# EAGLE schematic Main_Board_Rev_A1 (EAGLE 7.7.0)

## Sheet 1 of 5: Ethernet&CAN
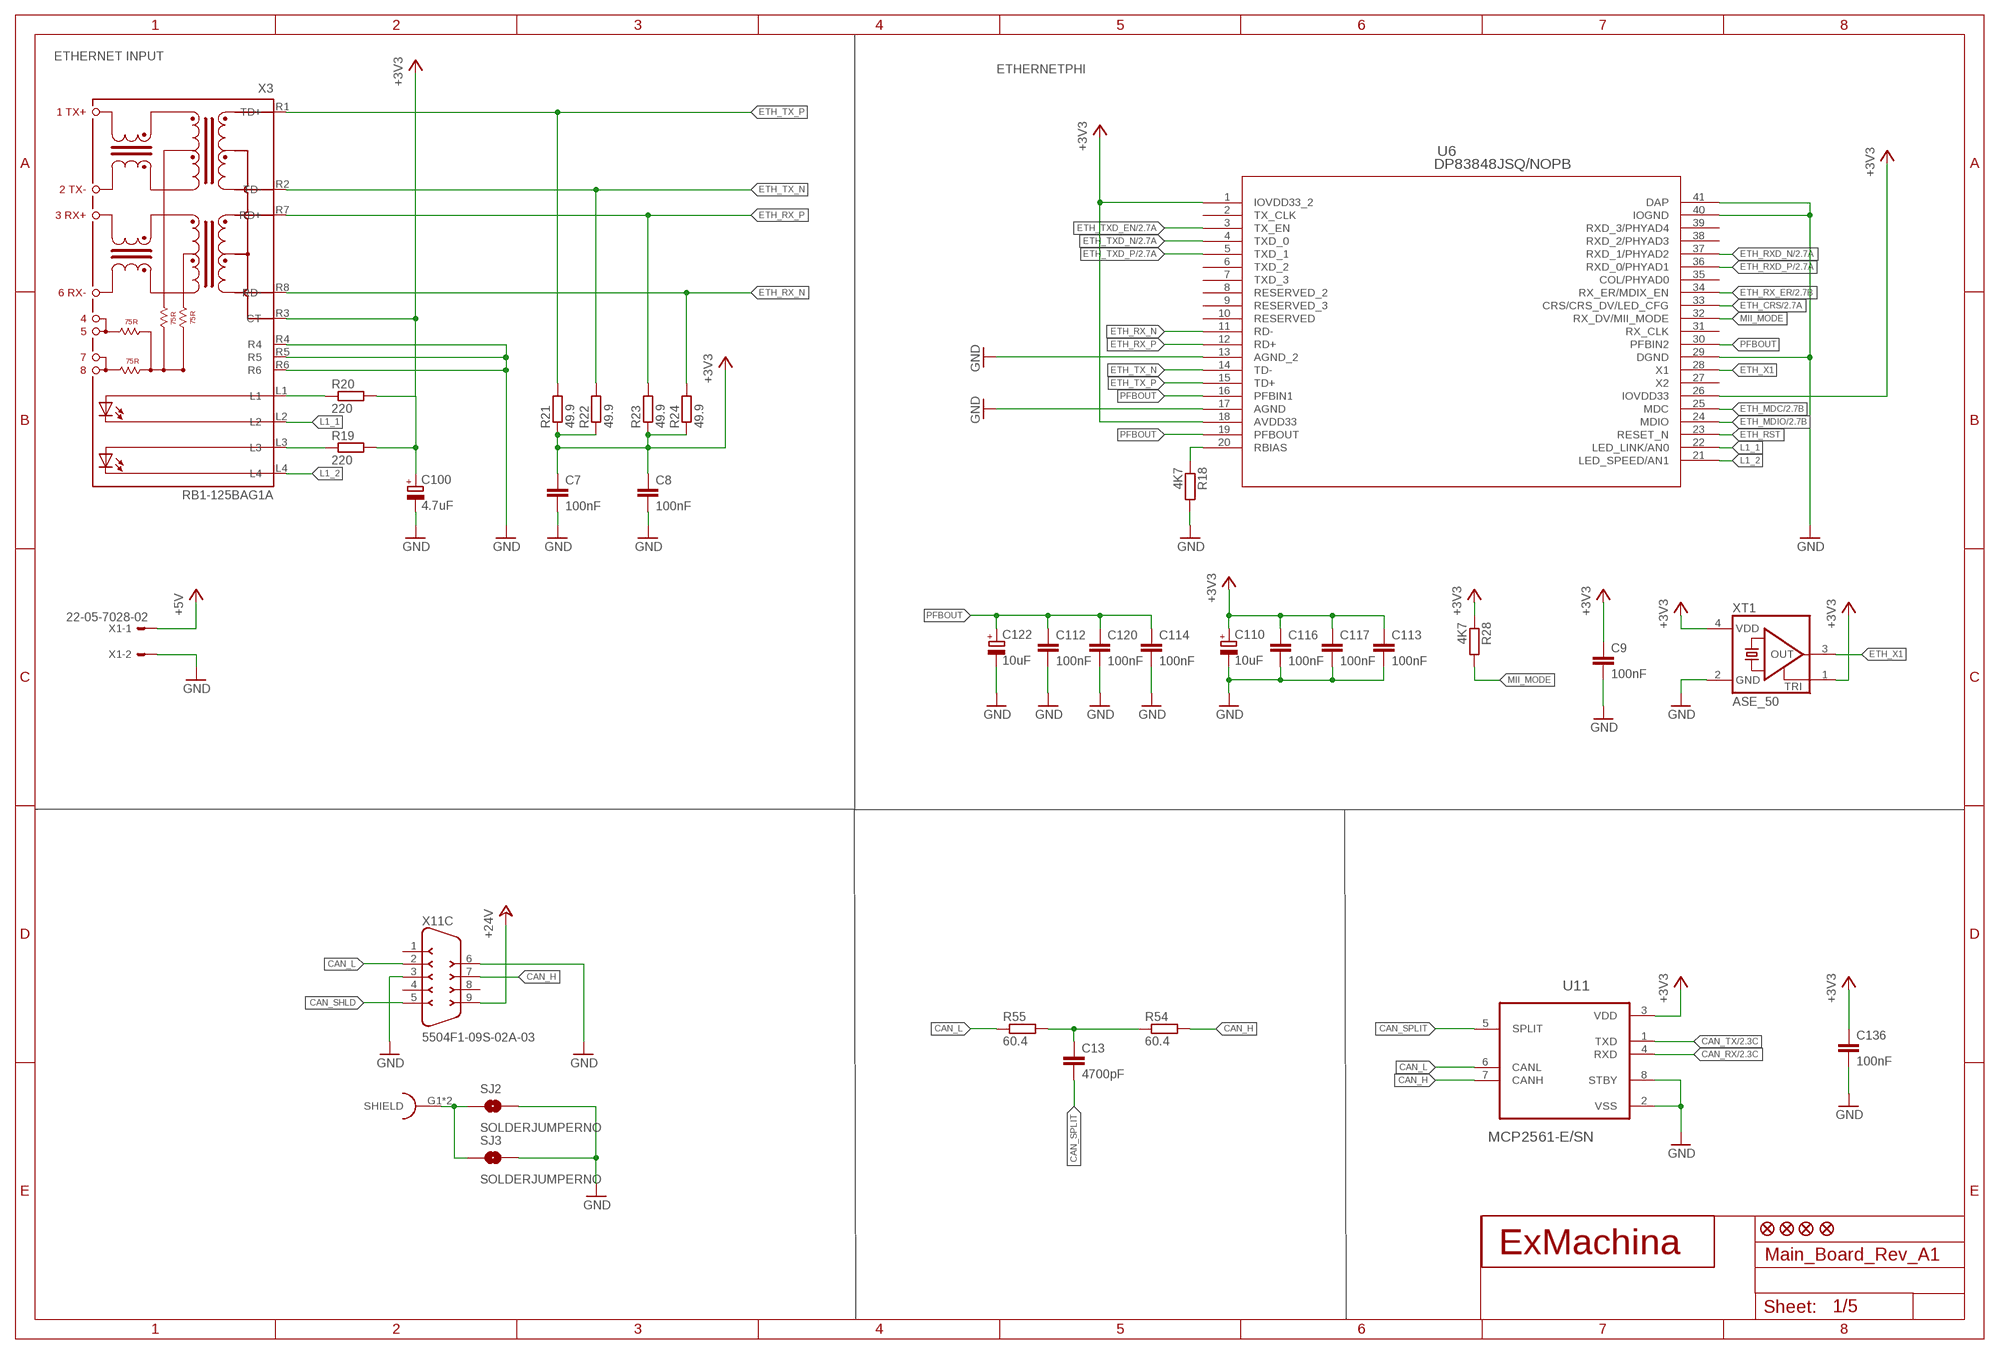
[diagram p0: schematic, sheet 1]

### Parts
C7  100nF  C-EUC0603  [C0603]
C8  100nF  C-EUC0603  [C0603]
C9  100nF  C-EUC0603  [C0603]
C13  4700pF  C-EUC0603  [C0603]
C100  4.7uF  CPOL-EUCT3216  [CT3216]
C110  10uF  CPOL-EUCT3216  [CT3216]
C112  100nF  C-EUC0603  [C0603]
C113  100nF  C-EUC0603  [C0603]
C114  100nF  C-EUC0603  [C0603]
C116  100nF  C-EUC0603  [C0603]
C117  100nF  C-EUC0603  [C0603]
C120  100nF  C-EUC0603  [C0603]
C122  10uF  CPOL-EUCT3216  [CT3216]
C136  100nF  C-EUC0603  [C0603]
JP1  FIDUCIAL1X2  [FIDUCIAL-1X2]
JP2  FIDUCIAL1X2  [FIDUCIAL-1X2]
JP4  FIDUCIAL1X2  [FIDUCIAL-1X2]
JP5  FIDUCIAL1X2  [FIDUCIAL-1X2]
R18  4K7  R-EU_R0603  [R0603]
R19  220  R-EU_R0603  [R0603]
R20  220  R-EU_R0603  [R0603]
R21  49.9  R-EU_R0603  [R0603]
R22  49.9  R-EU_R0603  [R0603]
R23  49.9  R-EU_R0603  [R0603]
R24  49.9  R-EU_R0603  [R0603]
R28  4K7  R-EU_R0603  [R0603]
R54  60.4  R-EU_R0603  [R0603]
R55  60.4  R-EU_R0603  [R0603]
SJ2  SOLDERJUMPERNO  [SJ_2S-NO]
SJ3  SOLDERJUMPERNO  [SJ_2S-NO]
U6  DP83848JSQ/NOPB  [SQA40B]
U11  MCP2561-E/SN  [SOIC127P600X175-8N]
U$2  EXMACHINA-LOGO-NAME  [EXM-LOGO-BASELINE]
X1  22-05-7028-02  [7395-02]
X3  RB1-125BAG1A  [WIZNET_RB1-125BAG1A]
X11  5504F1-09S-02A-03  [5504F1-09S-02A]
XT1  ASE_50  ASE  [ASE]

### Nets
+3V3 [supply]: C7.1 C8.1 C9.1 C100.+ C110.+ C113.1 C116.1 C117.1 C136.1 R19.2 R20.2 R21.1 R22.1 R23.1 R24.1 R28.1 U6.1(IOVDD33_2) U6.18(AVDD33) U6.26(IOVDD33) U11.3(VDD) X3.R3(CT) XT1.1(TRI) XT1.4(VDD) ; also sheet 2,3,4,5
+5V [supply]: X1.1 ; also sheet 3,4,5
+24V: X11.9 ; also sheet 3,5
CAN_H [signal]: R54.2 U11.7(CANH) X11.7
CAN_L [signal]: R55.1 U11.6(CANL) X11.2
CAN_RX [signal]: U11.4(RXD) ; also sheet 2
CAN_SHLD: X11.5
CAN_SPLIT [signal]: C13.2 U11.5(SPLIT)
CAN_TX [signal]: U11.1(TXD) ; also sheet 2
ETH_CRS [signal]: U6.33(CRS/CRS_DV/LED_CFG) ; also sheet 2
ETH_MDC [signal]: U6.25(MDC) ; also sheet 2
ETH_MDIO [signal]: U6.24(MDIO) ; also sheet 2
ETH_RST [signal]: U6.23(RESET_N)
ETH_RX_ER [signal]: U6.34(RX_ER/MDIX_EN) ; also sheet 2
ETH_RX_N [signal]: R24.2 U6.11(RD-) X3.R8(RD-)
ETH_RX_P [signal]: R23.2 U6.12(RD+) X3.R7(RD+)
ETH_RXD_N [signal]: U6.37(RXD_1/PHYAD2) ; also sheet 2
ETH_RXD_P [signal]: U6.36(RXD_0/PHYAD1) ; also sheet 2
ETH_TX_N [signal]: R22.2 U6.14(TD-) X3.R2(TD-)
ETH_TX_P [signal]: R21.2 U6.15(TD+) X3.R1(TD+)
ETH_TXD_EN [signal]: U6.3(TX_EN) ; also sheet 2
ETH_TXD_N [signal]: U6.4(TXD_0) ; also sheet 2
ETH_TXD_P [signal]: U6.5(TXD_1) ; also sheet 2
ETH_X1 [signal]: U6.28(X1) XT1.3(OUT)
GND [supply]: C7.2 C8.2 C9.2 C100.- C110.- C112.2 C113.2 C114.2 C116.2 C117.2 C120.2 C122.- C136.2 R18.2 SJ2.2 SJ3.2 U6.13(AGND_2) U6.17(AGND) U6.29(DGND) U6.40(IOGND) U6.41(DAP) U11.2(VSS) U11.8(STBY) X1.2 X3.R4 X3.R5 X3.R6 X11.3 X11.6 XT1.2(GND) ; also sheet 2,3,4,5
L1_1 [signal]: U6.22(LED_LINK/AN0) X3.L2
L1_2 [signal]: U6.21(LED_SPEED/AN1) X3.L4
MII_MODE [signal]: R28.2 U6.32(RX_DV/MII_MODE)
N$3: C13.1 R54.1 R55.2
N$4: R18.1 U6.20(RBIAS)
N$6: SJ2.1 SJ3.1 X11.G1(S:SHIELD) X11.G2(S:SHIELD)
N$8 [signal]: R20.1 X3.L1
N$9 [signal]: R19.1 X3.L3
PFBOUT [signal]: C112.1 C114.1 C120.1 C122.+ U6.16(PFBIN1) U6.19(PFBOUT) U6.30(PFBIN2)
Unconnected: U6.2(TX_CLK) U6.6(TXD_2) U6.7(TXD_3) U6.8(RESERVED_2) U6.9(RESERVED_3) U6.10(RESERVED) U6.27(X2) U6.31(RX_CLK) U6.35(COL/PHYAD0) U6.38(RXD_2/PHYAD3) U6.39(RXD_3/PHYAD4) X11.1 X11.4 X11.8

### Notes on the sheet
- ETHERNET INPUT
- ETHERNETPHI

## Sheet 2 of 5: LPC1768 + EEPROM
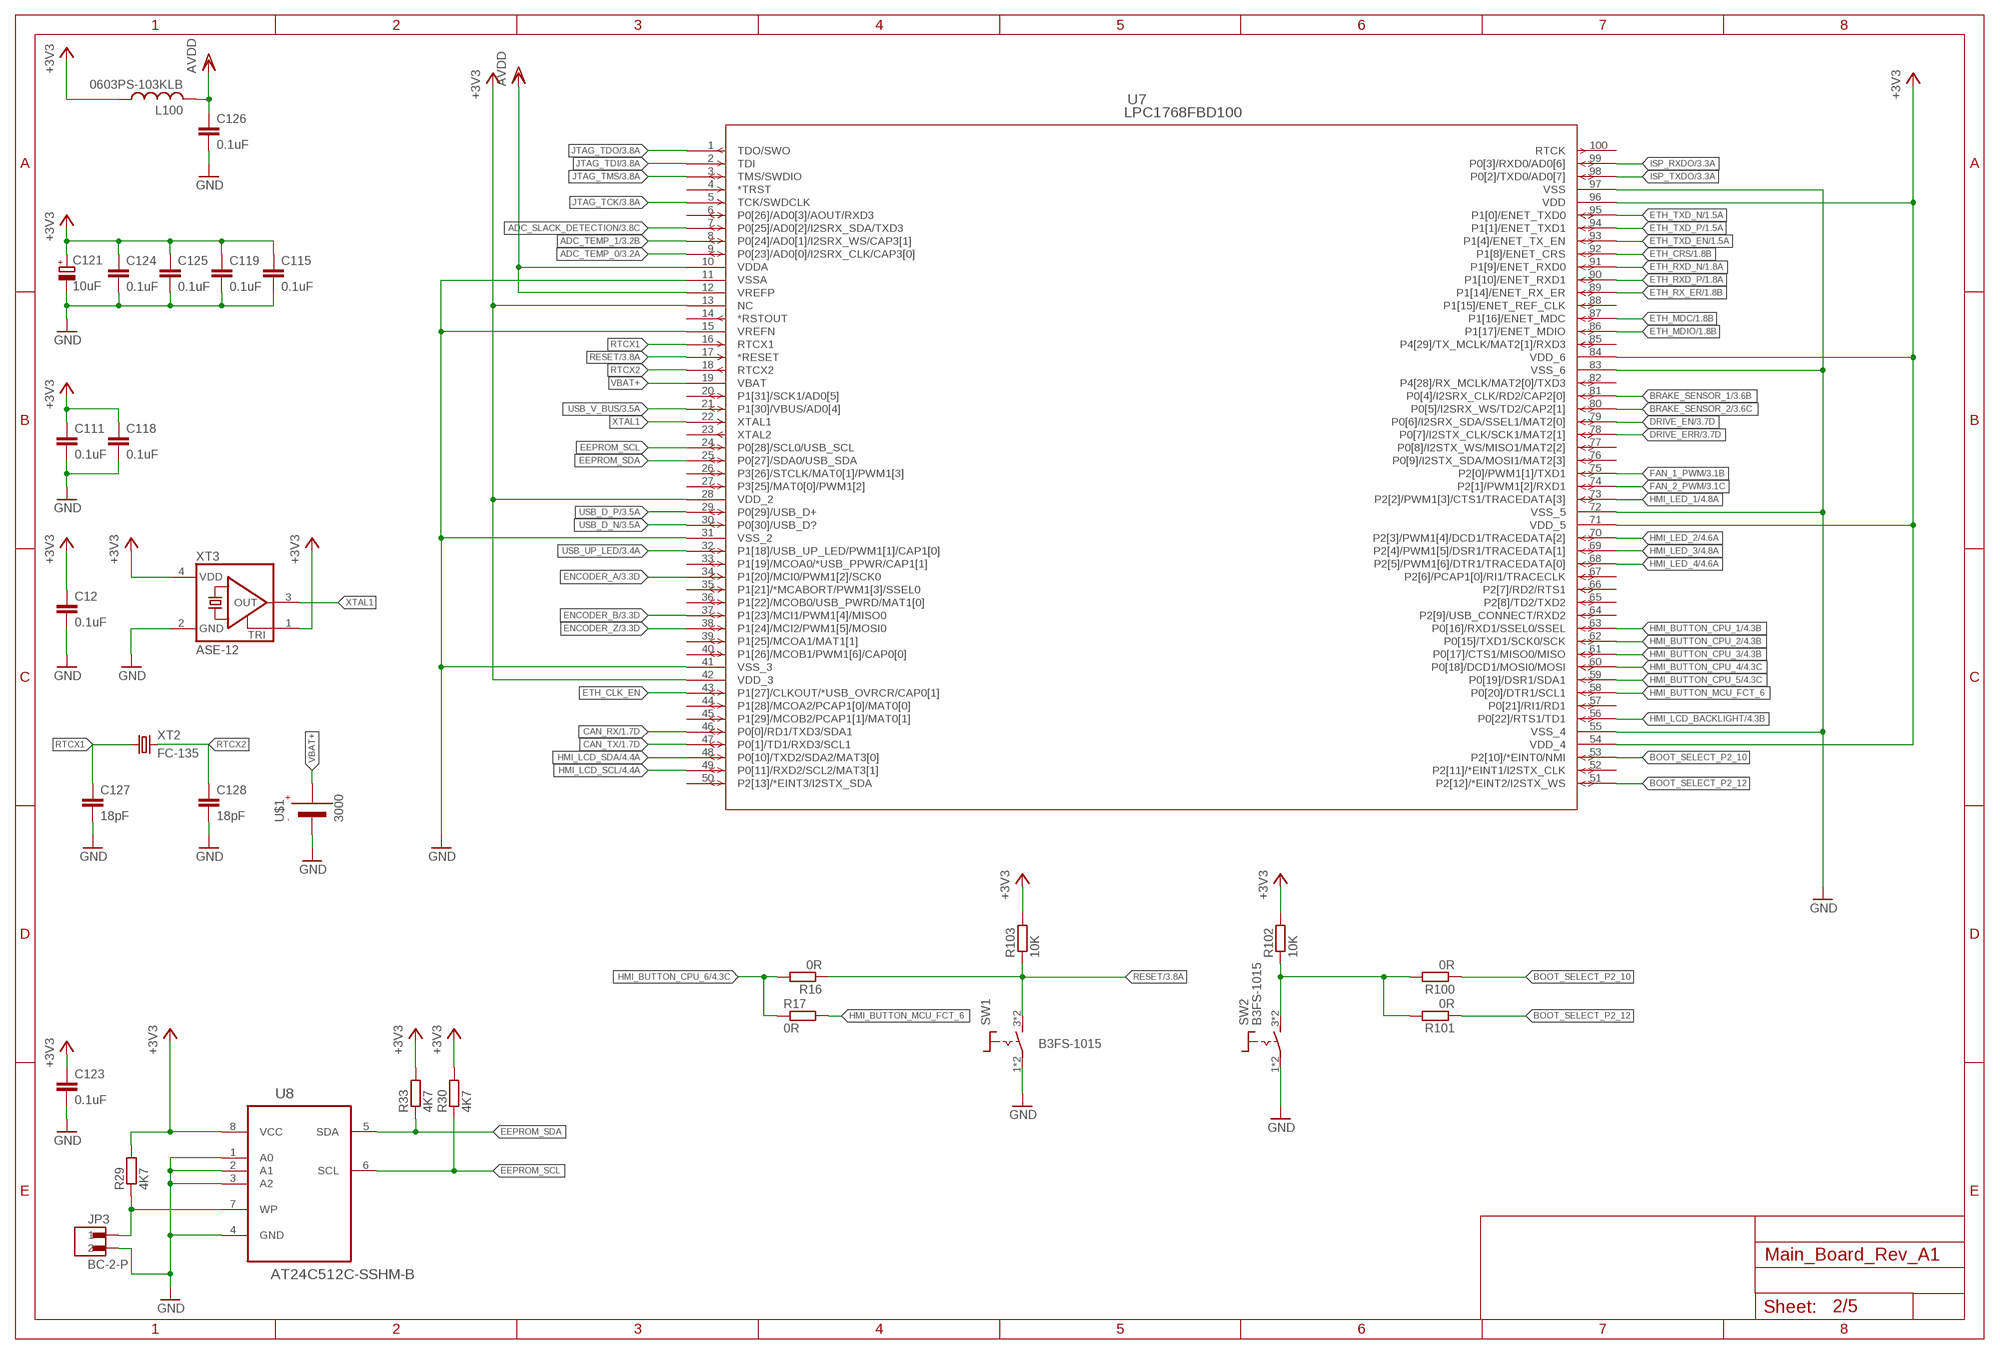
[diagram p1: schematic, sheet 2]

### Parts
C12  0.1uF  C-EUC0603  [C0603]
C111  0.1uF  C-EUC0603  [C0603]
C115  0.1uF  C-EUC0603  [C0603]
C118  0.1uF  C-EUC0603  [C0603]
C119  0.1uF  C-EUC0603  [C0603]
C121  10uF  CPOL-EUCT3216  [CT3216]
C123  0.1uF  C-EUC0603  [C0603]
C124  0.1uF  C-EUC0603  [C0603]
C125  0.1uF  C-EUC0603  [C0603]
C126  0.1uF  C-EUC0603  [C0603]
C127  18pF  C-EUC0603  [C0603]
C128  18pF  C-EUC0603  [C0603]
JP3  BC-2-P  [BC-2-P]
L100  0603PS-103KLB  0603PS  [0603]
R16  0R  R-EU_R0603  [R0603]
R17  0R  R-EU_R0603  [R0603]
R29  4K7  R-EU_R0603  [R0603]
R30  4K7  R-EU_R0603  [R0603]
R33  4K7  R-EU_R0603  [R0603]
R100  0R  R-EU_R0603  [R0603]
R101  0R  R-EU_R0603  [R0603]
R102  10K  R-EU_R0603  [R0603]
R103  10K  R-EU_R0603  [R0603]
SW1  B3FS-1015  [B3FS]
SW2  B3FS-1015  [B3FS]
U7  LPC1768FBD100  [SOT407-1]
U8  AT24C512C-SSHM-B  [SOIC127P600X175-8N]
U$1  3000  [3000]
XT2  FC-135  [FC-135]
XT3  ASE-12  ASE  [ASE]

### Nets
+3V3 [supply]: C12.1 C111.1 C115.1 C118.1 C119.1 C121.+ C123.1 C124.1 C125.1 L100.P$1 R29.2 R30.2 R33.2 R102.2 R103.2 U7.13(NC) U7.28(VDD_2) U7.42(VDD_3) U7.54(VDD_4) U7.71(VDD_5) U7.84(VDD_6) U7.96(VDD) U8.8(VCC) XT3.1(TRI) XT3.4(VDD) ; also sheet 1,3,4,5
ADC_SLACK_DETECTION [signal]: U7.7(P0[25]/AD0[2]/I2SRX_SDA/TXD3) ; also sheet 3
ADC_TEMP_0 [signal]: U7.9(P0[23]/AD0[0]/I2SRX_CLK/CAP3[0]) ; also sheet 3
ADC_TEMP_1 [signal]: U7.8(P0[24]/AD0[1]/I2SRX_WS/CAP3[1]) ; also sheet 3
AVDD: C126.1 L100.P$2 U7.10(VDDA) U7.12(VREFP) ; also sheet 3
BOOT_SELECT_P2_10 [signal]: R100.1 U7.53(P2[10]/*EINT0/NMI)
BOOT_SELECT_P2_12 [signal]: R101.1 U7.51(P2[12]/*EINT2/I2STX_WS)
BRAKE_SENSOR_1: U7.81(P0[4]/I2SRX_CLK/RD2/CAP2[0]) ; also sheet 3
BRAKE_SENSOR_2: U7.80(P0[5]/I2SRX_WS/TD2/CAP2[1]) ; also sheet 3
CAN_RX [signal]: U7.46(P0[0]/RD1/TXD3/SDA1) ; also sheet 1
CAN_TX [signal]: U7.47(P0[1]/TD1/RXD3/SCL1) ; also sheet 1
DRIVE_EN: U7.79(P0[6]/I2SRX_SDA/SSEL1/MAT2[0]) ; also sheet 3
DRIVE_ERR: U7.78(P0[7]/I2STX_CLK/SCK1/MAT2[1]) ; also sheet 3
EEPROM_SCL: R30.1 U7.24(P0[28]/SCL0/USB_SCL) U8.6(SCL)
EEPROM_SDA: R33.1 U7.25(P0[27]/SDA0/USB_SDA) U8.5(SDA)
ENCODER_A: U7.34(P1[20]/MCI0/PWM1[2]/SCK0) ; also sheet 3
ENCODER_B: U7.37(P1[23]/MCI1/PWM1[4]/MISO0) ; also sheet 3
ENCODER_Z: U7.38(P1[24]/MCI2/PWM1[5]/MOSI0) ; also sheet 3
ETH_CLK_EN [signal]: U7.43(P1[27]/CLKOUT/*USB_OVRCR/CAP0[1])
ETH_CRS [signal]: U7.92(P1[8]/ENET_CRS) ; also sheet 1
ETH_MDC [signal]: U7.87(P1[16]/ENET_MDC) ; also sheet 1
ETH_MDIO [signal]: U7.86(P1[17]/ENET_MDIO) ; also sheet 1
ETH_RX_ER [signal]: U7.89(P1[14]/ENET_RX_ER) ; also sheet 1
ETH_RXD_N [signal]: U7.91(P1[9]/ENET_RXD0) ; also sheet 1
ETH_RXD_P [signal]: U7.90(P1[10]/ENET_RXD1) ; also sheet 1
ETH_TXD_EN [signal]: U7.93(P1[4]/ENET_TX_EN) ; also sheet 1
ETH_TXD_N [signal]: U7.95(P1[0]/ENET_TXD0) ; also sheet 1
ETH_TXD_P [signal]: U7.94(P1[1]/ENET_TXD1) ; also sheet 1
FAN_1_PWM [signal]: U7.75(P2[0]/PWM1[1]/TXD1) ; also sheet 3
FAN_2_PWM [signal]: U7.74(P2[1]/PWM1[2]/RXD1) ; also sheet 3
GND [supply]: C12.2 C111.2 C115.2 C118.2 C119.2 C121.- C123.2 C124.2 C125.2 C126.2 C127.2 C128.2 JP3.2 SW1.1 SW1.2 SW2.1 SW2.2 U7.11(VSSA) U7.15(VREFN) U7.31(VSS_2) U7.41(VSS_3) U7.55(VSS_4) U7.72(VSS_5) U7.83(VSS_6) U7.97(VSS) U8.1(A0) U8.2(A1) U8.3(A2) U8.4(GND) U$1.-(VBAT-) XT3.2(GND) ; also sheet 1,3,4,5
HMI_BUTTON_CPU_1: U7.63(P0[16]/RXD1/SSEL0/SSEL) ; also sheet 4
HMI_BUTTON_CPU_2: U7.62(P0[15]/TXD1/SCK0/SCK) ; also sheet 4
HMI_BUTTON_CPU_3: U7.61(P0[17]/CTS1/MISO0/MISO) ; also sheet 4
HMI_BUTTON_CPU_4: U7.60(P0[18]/DCD1/MOSI0/MOSI) ; also sheet 4
HMI_BUTTON_CPU_5: U7.59(P0[19]/DSR1/SDA1) ; also sheet 4
HMI_BUTTON_CPU_6: R16.2 R17.1 ; also sheet 4
HMI_BUTTON_MCU_FCT_6: R17.2 U7.58(P0[20]/DTR1/SCL1)
HMI_LCD_BACKLIGHT: U7.56(P0[22]/RTS1/TD1) ; also sheet 4
HMI_LCD_SCL [signal]: U7.49(P0[11]/RXD2/SCL2/MAT3[1]) ; also sheet 4
HMI_LCD_SDA [signal]: U7.48(P0[10]/TXD2/SDA2/MAT3[0]) ; also sheet 4
HMI_LED_1 [signal]: U7.73(P2[2]/PWM1[3]/CTS1/TRACEDATA[3]) ; also sheet 4
HMI_LED_2 [signal]: U7.70(P2[3]/PWM1[4]/DCD1/TRACEDATA[2]) ; also sheet 4
HMI_LED_3 [signal]: U7.69(P2[4]/PWM1[5]/DSR1/TRACEDATA[1]) ; also sheet 4
HMI_LED_4 [signal]: U7.68(P2[5]/PWM1[6]/DTR1/TRACEDATA[0]) ; also sheet 4
ISP_RXDO [signal]: U7.99(P0[3]/RXD0/AD0[6]) ; also sheet 3
ISP_TXDO [signal]: U7.98(P0[2]/TXD0/AD0[7]) ; also sheet 3
JTAG_TCK [signal]: U7.5(TCK/SWDCLK) ; also sheet 3
JTAG_TDI [signal]: U7.2(TDI) ; also sheet 3
JTAG_TDO [signal]: U7.1(TDO/SWO) ; also sheet 3
JTAG_TMS [signal]: U7.3(TMS/SWDIO) ; also sheet 3
N$5 [signal]: R100.2 R101.2 R102.1 SW2.3 SW2.4
N$22: JP3.1 R29.1 U8.7(WP)
RESET: R16.1 R103.1 SW1.3 SW1.4 U7.17(*RESET) ; also sheet 3
RTCX1: C127.1 U7.16(RTCX1) XT2.1
RTCX2: C128.1 U7.18(RTCX2) XT2.2
USB_D_N [signal]: U7.30(P0[30]/USB_D?) ; also sheet 3
USB_D_P [signal]: U7.29(P0[29]/USB_D+) ; also sheet 3
USB_UP_LED [signal]: U7.32(P1[18]/USB_UP_LED/PWM1[1]/CAP1[0]) ; also sheet 3
USB_V_BUS [signal]: U7.21(P1[30]/VBUS/AD0[4]) ; also sheet 3
VBAT+: U7.19(VBAT) U$1.+1(VBAT+) U$1.+2(VBAT+)
XTAL1: U7.22(XTAL1) XT3.3(OUT)
Unconnected: U7.4(*TRST) U7.6(P0[26]/AD0[3]/AOUT/RXD3) U7.14(*RSTOUT) U7.20(P1[31]/SCK1/AD0[5]) U7.23(XTAL2) U7.26(P3[26]/STCLK/MAT0[1]/PWM1[3]) U7.27(P3[25]/MAT0[0]/PWM1[2]) U7.33(P1[19]/MCOA0/*USB_PPWR/CAP1[1]) U7.35(P1[21]/*MCABORT/PWM1[3]/SSEL0) U7.36(P1[22]/MCOB0/USB_PWRD/MAT1[0]) U7.39(P1[25]/MCOA1/MAT1[1]) U7.40(P1[26]/MCOB1/PWM1[6]/CAP0[0]) U7.44(P1[28]/MCOA2/PCAP1[0]/MAT0[0]) U7.45(P1[29]/MCOB2/PCAP1[1]/MAT0[1]) U7.50(P2[13]/*EINT3/I2STX_SDA) U7.52(P2[11]/*EINT1/I2STX_CLK) U7.57(P0[21]/RI1/RD1) U7.64(P2[9]/USB_CONNECT/RXD2) U7.65(P2[8]/TD2/TXD2) U7.66(P2[7]/RD2/RTS1) U7.67(P2[6]/PCAP1[0]/RI1/TRACECLK) U7.76(P0[9]/I2STX_SDA/MOSI1/MAT2[3]) U7.77(P0[8]/I2STX_WS/MISO1/MAT2[2]) U7.82(P4[28]/RX_MCLK/MAT2[0]/TXD3) U7.85(P4[29]/TX_MCLK/MAT2[1]/RXD3) U7.88(P1[15]/ENET_REF_CLK) U7.100(RTCK)

## Sheet 3 of 5: Motor Sensors
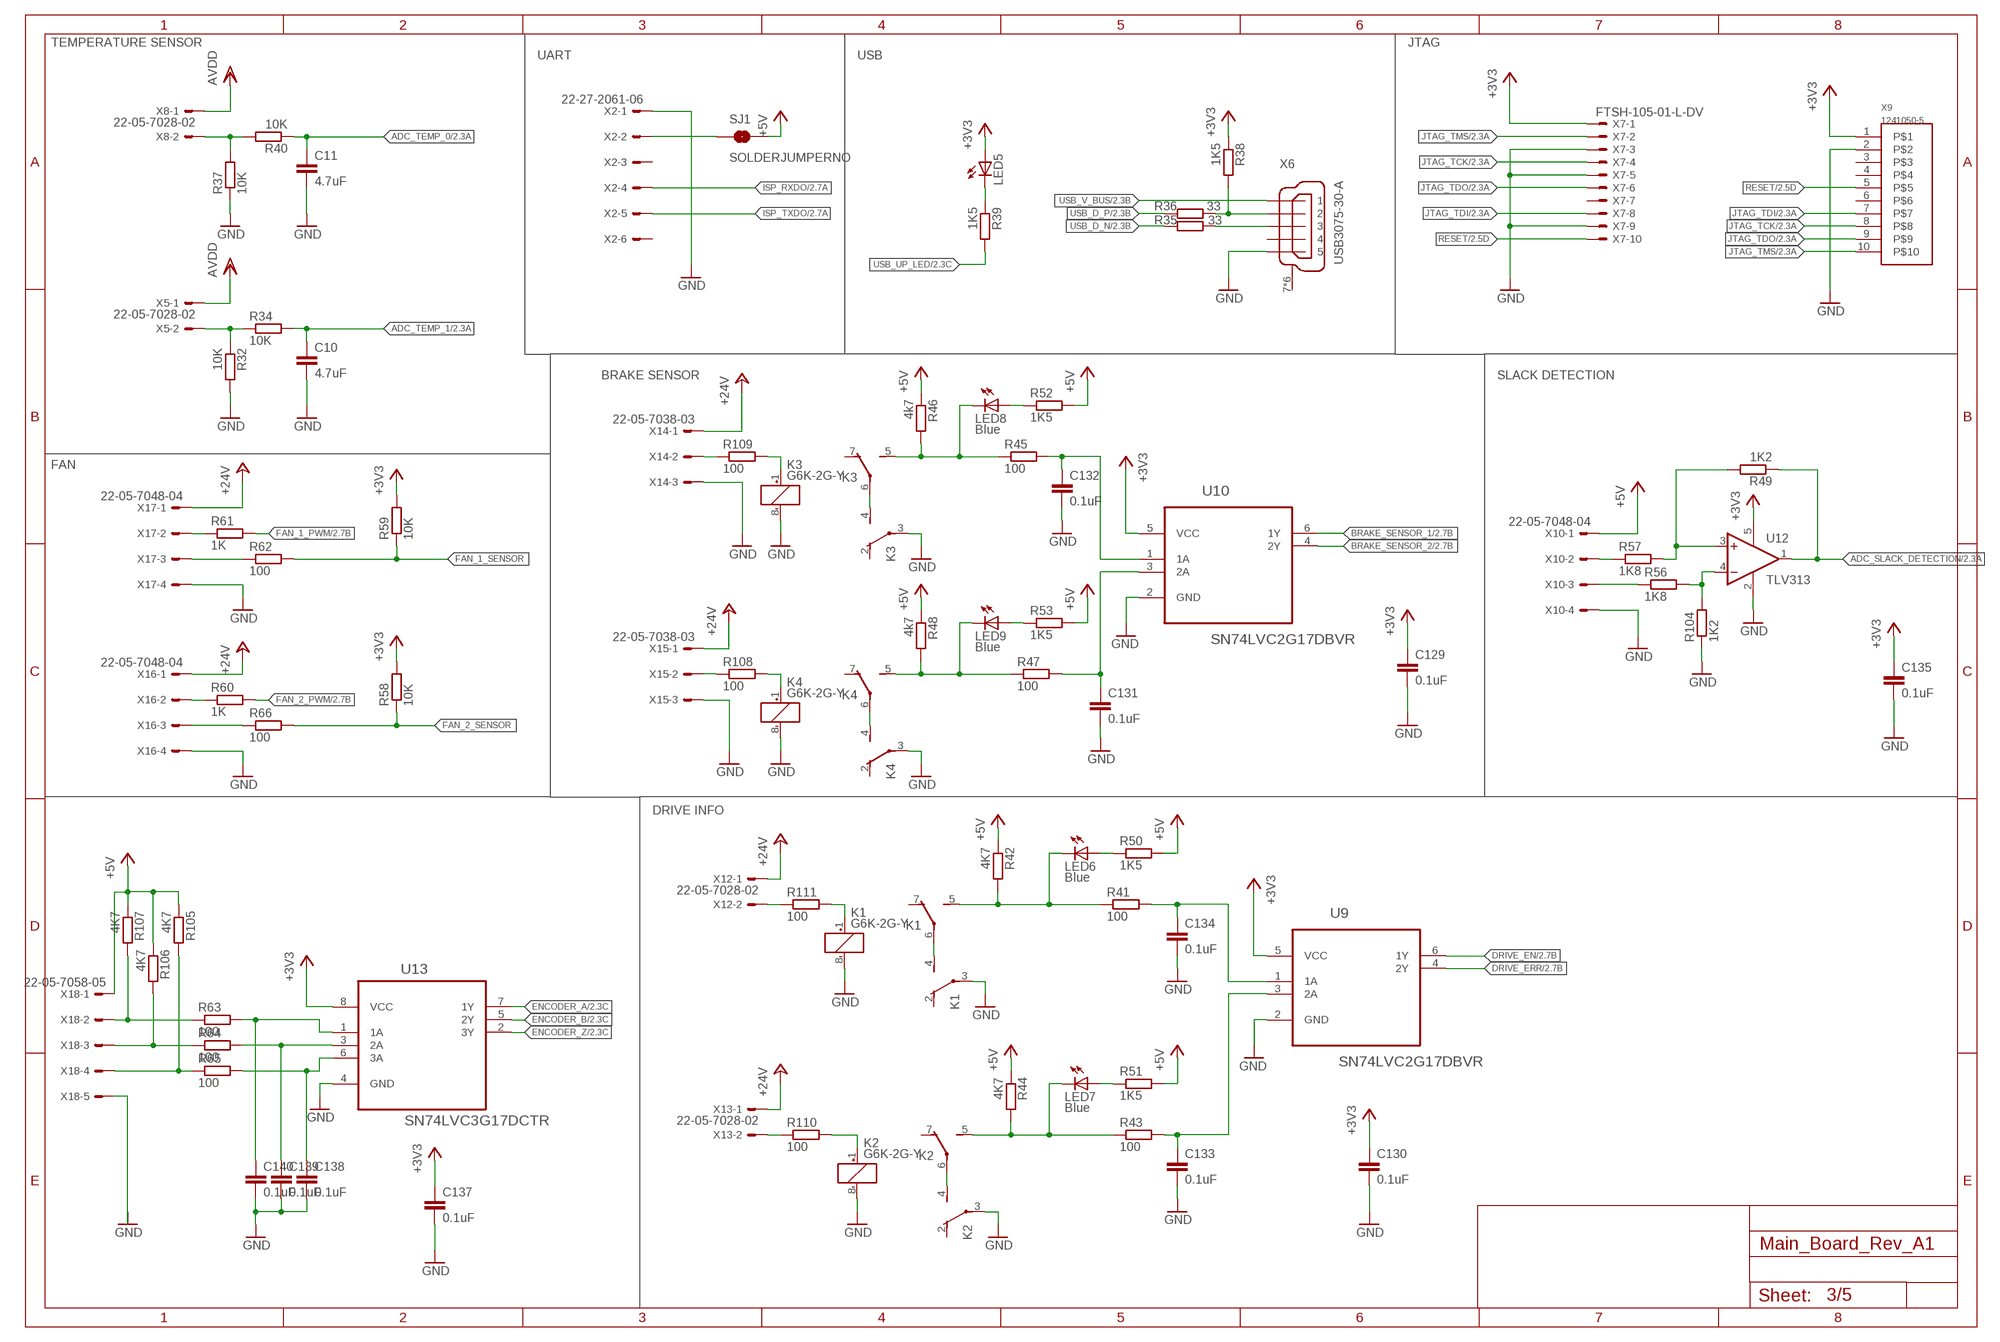
[diagram p2: schematic, sheet 3]

### Parts
C10  4.7uF  C-EUC0603  [C0603]
C11  4.7uF  C-EUC0603  [C0603]
C129  0.1uF  C-EUC0603  [C0603]
C130  0.1uF  C-EUC0603  [C0603]
C131  0.1uF  C-EUC0603  [C0603]
C132  0.1uF  C-EUC0603  [C0603]
C133  0.1uF  C-EUC0603  [C0603]
C134  0.1uF  C-EUC0603  [C0603]
C135  0.1uF  C-EUC0603  [C0603]
C137  0.1uF  C-EUC0603  [C0603]
C138  0.1uF  C-EUC0603  [C0603]
C139  0.1uF  C-EUC0603  [C0603]
C140  0.1uF  C-EUC0603  [C0603]
K1  G6K-2G-Y  [G6K-2G-Y]
K2  G6K-2G-Y  [G6K-2G-Y]
K3  G6K-2G-Y  [G6K-2G-Y]
K4  G6K-2G-Y  [G6K-2G-Y]
LED5  LEDCHIPLED_0603  [CHIPLED_0603]
LED6  Blue  LEDCHIPLED_0603  [CHIPLED_0603]
LED7  Blue  LEDCHIPLED_0603  [CHIPLED_0603]
LED8  Blue  LEDCHIPLED_0603  [CHIPLED_0603]
LED9  Blue  LEDCHIPLED_0603  [CHIPLED_0603]
R32  10K  R-EU_R0603  [R0603]
R34  10K  R-EU_R0603  [R0603]
R35  33  R-EU_R0603  [R0603]
R36  33  R-EU_R0603  [R0603]
R37  10K  R-EU_R0603  [R0603]
R38  1K5  R-EU_R0603  [R0603]
R39  1K5  R-EU_R0603  [R0603]
R40  10K  R-EU_R0603  [R0603]
R41  100  R-EU_R0603  [R0603]
R42  4K7  R-EU_R0603  [R0603]
R43  100  R-EU_R0603  [R0603]
R44  4K7  R-EU_R0603  [R0603]
R45  100  R-EU_R0603  [R0603]
R46  4k7  R-EU_R0603  [R0603]
R47  100  R-EU_R0603  [R0603]
R48  4k7  R-EU_R0603  [R0603]
R49  1K2  R-EU_R0603  [R0603]
R50  1K5  R-EU_R0603  [R0603]
R51  1K5  R-EU_R0603  [R0603]
R52  1K5  R-EU_R0603  [R0603]
R53  1K5  R-EU_R0603  [R0603]
R56  1K8  R-EU_R0603  [R0603]
R57  1K8  R-EU_R0603  [R0603]
R58  10K  R-EU_R0603  [R0603]
R59  10K  R-EU_R0603  [R0603]
R60  1K  R-EU_R0603  [R0603]
R61  1K  R-EU_R0603  [R0603]
R62  100  R-EU_R0603  [R0603]
R63  100  R-EU_R0603  [R0603]
R64  100  R-EU_R0603  [R0603]
R65  100  R-EU_R0603  [R0603]
R66  100  R-EU_R0603  [R0603]
R104  1K2  R-EU_R0603  [R0603]
R105  4K7  R-EU_R0603  [R0603]
R106  4K7  R-EU_R0603  [R0603]
R107  4K7  R-EU_R0603  [R0603]
R108  100  R-EU_R0603  [R0603]
R109  100  R-EU_R0603  [R0603]
R110  100  R-EU_R0603  [R0603]
R111  100  R-EU_R0603  [R0603]
SJ1  SOLDERJUMPERNO  [SJ_2S-NO]
U9  SN74LVC2G17DBVR  [SOT95P280X145-6N]
U10  SN74LVC2G17DBVR  [SOT95P280X145-6N]
U12  TLV313  [SOT23-DBV]
U13  SN74LVC3G17DCTR  [SOP65P400X130-8N]
X2  22-27-2061-06  [6410-06]
X5  22-05-7028-02  [7395-02]
X6  USB3075-30-A  [USB_MICROB_SMT]
X7  FTSH-105-01-L-DV  [FTSH-105-01-L-DV]
X8  22-05-7028-02  [7395-02]
X9  1241050-5  [2.54/2X5]
X10  22-05-7048-04  [7395-04]
X12  22-05-7028-02  [7395-02]
X13  22-05-7028-02  [7395-02]
X14  22-05-7038-03  [7395-03]
X15  22-05-7038-03  [7395-03]
X16  22-05-7048-04  [7395-04]
X17  22-05-7048-04  [7395-04]
X18  22-05-7058-05  [7395-05]

### Nets
+3V3 [supply]: C129.1 C130.1 C135.1 C137.1 LED5.A R38.1 R58.2 R59.2 U9.5(VCC) U10.5(VCC) U12.5(V+) U13.8(VCC) X7.1 X9.1 ; also sheet 1,2,4,5
+5V [supply]: R42.1 R44.1 R46.1 R48.1 R50.2 R51.2 R52.2 R53.2 R105.1 R106.1 R107.1 SJ1.2 X10.1 X18.1 ; also sheet 1,4,5
+24V: X12.1 X13.1 X14.1 X15.1 X16.1 X17.1 ; also sheet 1,5
ADC_SLACK_DETECTION [signal]: R49.1 U12.1(OUT) ; also sheet 2
ADC_TEMP_0 [signal]: C11.1 R40.1 ; also sheet 2
ADC_TEMP_1 [signal]: C10.1 R34.2 ; also sheet 2
AVDD: X5.1 X8.1 ; also sheet 2
BRAKE_SENSOR_1: U10.6(1Y) ; also sheet 2
BRAKE_SENSOR_2: U10.4(2Y) ; also sheet 2
DRIVE_EN: U9.6(1Y) ; also sheet 2
DRIVE_ERR: U9.4(2Y) ; also sheet 2
ENCODER_A: U13.7(1Y) ; also sheet 2
ENCODER_B: U13.5(2Y) ; also sheet 2
ENCODER_Z: U13.2(3Y) ; also sheet 2
FAN_1_PWM [signal]: R61.2 ; also sheet 2
FAN_1_SENSOR [signal]: R59.1 R62.2
FAN_2_PWM [signal]: R60.2 ; also sheet 2
FAN_2_SENSOR [signal]: R58.1 R66.2
GND [supply]: C10.2 C11.2 C129.2 C130.2 C131.2 C132.2 C133.2 C134.2 C135.2 C137.2 C138.2 C139.2 C140.2 K1.3(2:P) K1.8(1:-) K2.3(2:P) K2.8(1:-) K3.3(2:P) K3.8(1:-) K4.3(2:P) K4.8(1:-) R32.2 R37.1 R104.1 U9.2(GND) U10.2(GND) U12.2(V-) U13.4(GND) X2.1 X6.5 X7.3 X7.5 X7.9 X9.2 X10.4 X14.3 X15.3 X16.4 X17.4 ; also sheet 1,2,4,5
ISP_RXDO [signal]: X2.4 ; also sheet 2
ISP_TXDO [signal]: X2.5 ; also sheet 2
JTAG_TCK [signal]: X7.4 X9.8 ; also sheet 2
JTAG_TDI [signal]: X7.8 X9.7 ; also sheet 2
JTAG_TDO [signal]: X7.6 X9.9 ; also sheet 2
JTAG_TMS [signal]: X7.2 X9.10 ; also sheet 2
N$11 [signal]: R61.1 X17.2
N$12 [signal]: R66.1 X16.3
N$13 [signal]: R60.1 X16.2
N$14 [signal]: R62.1 X17.3
N$15 [signal]: R36.1 R38.2 X6.2
N$16 [signal]: R35.1 X6.3
N$18 [signal]: LED5.C R39.1
N$21: R109.1 X14.2
N$23: R108.1 X15.2
N$24: K3.1(1:+) R109.2
N$28: K1.1(1:+) R111.2
N$29: K3.4(2:S) K3.6(3:P)
N$31: R57.1 X10.2
N$32: R111.1 X12.2
N$33: K2.1(1:+) R110.2
N$35: R63.1 R107.2 X18.2
N$37: R110.1 X13.2
N$38: C131.1 R47.2 U10.3(2A)
N$39: C132.1 R45.2 U10.1(1A)
N$40: R64.1 R106.2 X18.3
N$41: C134.1 R41.2 U9.1(1A)
N$42: C133.1 R43.2 U9.3(2A)
N$46: R65.1 R105.2 X18.4
N$52: C138.1 R65.2 U13.6(3A)
N$53: C139.1 R64.2 U13.3(2A)
N$54: C140.1 R63.2 U13.1(1A)
N$55: K4.1(1:+) R108.2
N$57: K4.4(2:S) K4.6(3:P)
N$58: K3.5(3:S) LED8.C R45.1 R46.2
N$59: K2.4(2:S) K2.6(3:P)
N$60: K1.4(2:S) K1.6(3:P)
N$61: R49.2 R57.2 U12.3(+IN)
N$62: X18.5
N$65: R37.2 R40.2 X8.2
N$66: R32.1 R34.1 X5.2
N$67: R56.2 R104.2 U12.4(-IN)
N$68: R56.1 X10.3
N$69: SJ1.1 X2.2
N$70: LED8.A R52.1
N$71: K4.5(3:S) LED9.C R47.1 R48.2
N$72: LED9.A R53.1
N$73: K1.5(3:S) LED6.C R41.1 R42.2
N$74: LED6.A R50.1
N$75: K2.5(3:S) LED7.C R43.1 R44.2
N$76: LED7.A R51.1
RESET: X7.10 X9.5 ; also sheet 2
USB_D_N [signal]: R35.2 ; also sheet 2
USB_D_P [signal]: R36.2 ; also sheet 2
USB_UP_LED [signal]: R39.2 ; also sheet 2
USB_V_BUS [signal]: X6.1 ; also sheet 2
Unconnected: K1.2(2:O) K1.7(3:O) K2.2(2:O) K2.7(3:O) K3.2(2:O) K3.7(3:O) K4.2(2:O) K4.7(3:O) X2.3 X2.6 X6.4 X6.7(S) X6.8(S) X6.9(S) X6.10(S) X6.11(S) X6.12(S) X7.7 X9.3 X9.4 X9.6

### Notes on the sheet
- TEMPERATURE SENSOR | JTAG
- UART | USB
- BRAKE SENSOR | SLACK DETECTION
- FAN
- DRIVE INFO

## Sheet 4 of 5: HMI Interface
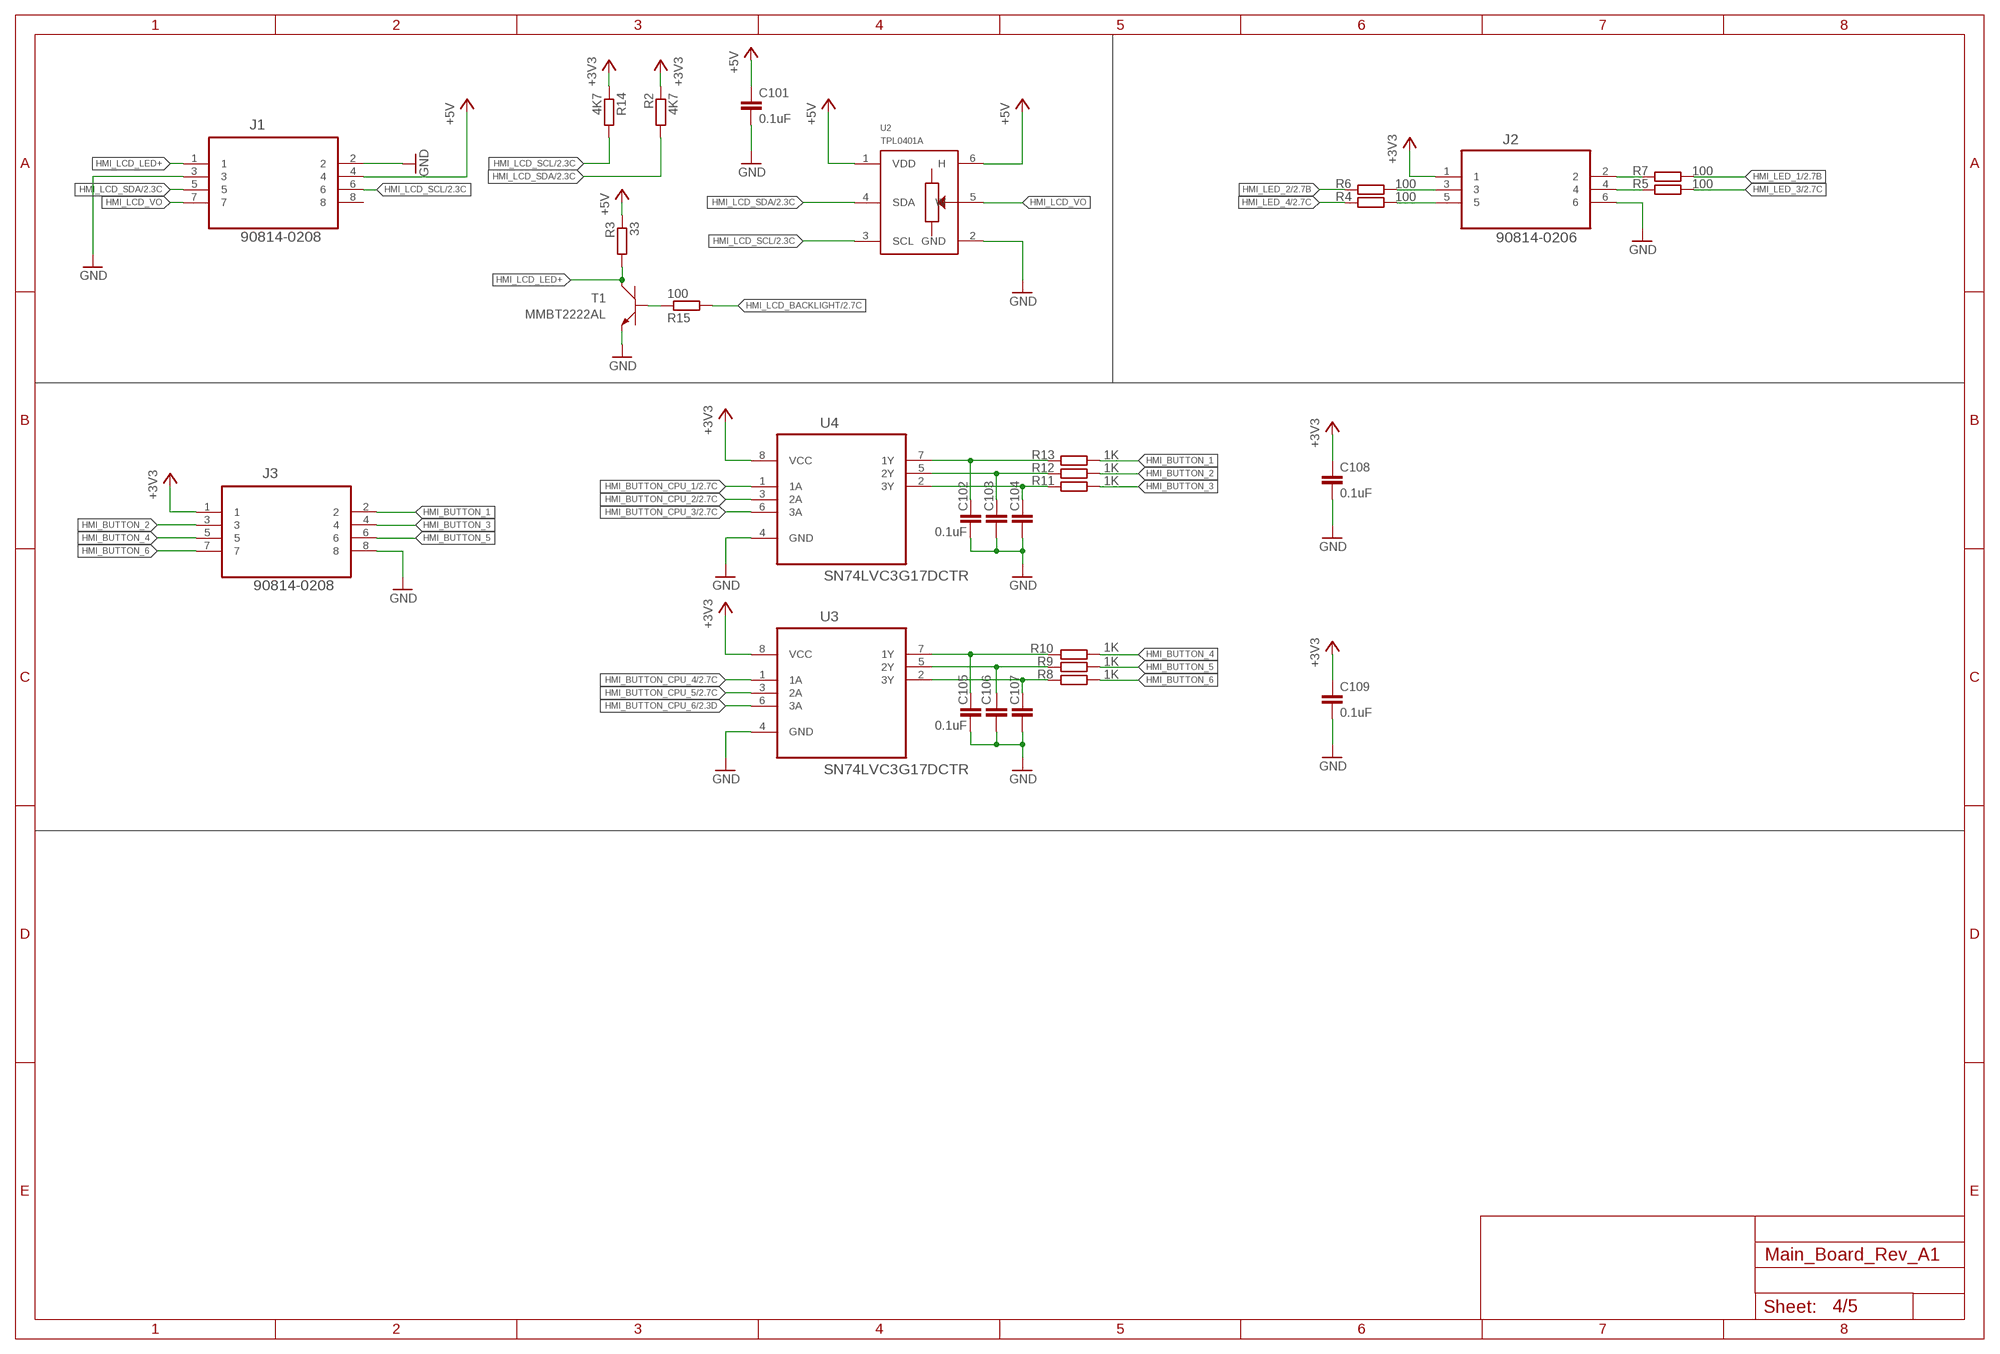
[diagram p3: schematic, sheet 4]

### Parts
C101  0.1uF  C-EUC0603  [C0603]
C102  0.1uF  C-EUC0603  [C0603]
C103  0.1uF  C-EUC0603  [C0603]
C104  0.1uF  C-EUC0603  [C0603]
C105  0.1uF  C-EUC0603  [C0603]
C106  0.1uF  C-EUC0603  [C0603]
C107  0.1uF  C-EUC0603  [C0603]
C108  0.1uF  C-EUC0603  [C0603]
C109  0.1uF  C-EUC0603  [C0603]
J1  90814-0208  [MOLEX_90814-0208]
J2  90814-0206  [MOLEX_90814-0206]
J3  90814-0208  [MOLEX_90814-0208]
R2  4K7  R-EU_R0603  [R0603]
R3  33  R-EU_R0603  [R0603]
R4  100  R-EU_R0603  [R0603]
R5  100  R-EU_R0603  [R0603]
R6  100  R-EU_R0603  [R0603]
R7  100  R-EU_R0603  [R0603]
R8  1K  R-EU_R0603  [R0603]
R9  1K  R-EU_R0603  [R0603]
R10  1K  R-EU_R0603  [R0603]
R11  1K  R-EU_R0603  [R0603]
R12  1K  R-EU_R0603  [R0603]
R13  1K  R-EU_R0603  [R0603]
R14  4K7  R-EU_R0603  [R0603]
R15  100  R-EU_R0603  [R0603]
T1  MMBT2222AL  [SOT−23]
U2  TPL0401A  [SC-70-DCK]
U3  SN74LVC3G17DCTR  [SOP65P400X130-8N]
U4  SN74LVC3G17DCTR  [SOP65P400X130-8N]

### Nets
+3V3 [supply]: C108.1 C109.1 J2.1 J3.1 R2.1 R14.1 U3.8(VCC) U4.8(VCC) ; also sheet 1,2,3,5
+5V [supply]: C101.1 J1.4 R3.1 U2.1(VDD) U2.6(H) ; also sheet 1,3,5
GND [supply]: C101.2 C102.2 C103.2 C104.2 C105.2 C106.2 C107.2 C108.2 C109.2 J1.2 J1.3 J2.6 J3.8 T1.2(E) U2.2(GND) U3.4(GND) U4.4(GND) ; also sheet 1,2,3,5
HMI_BUTTON_1 [signal]: J3.2 R13.1
HMI_BUTTON_2 [signal]: J3.3 R12.1
HMI_BUTTON_3 [signal]: J3.4 R11.1
HMI_BUTTON_4 [signal]: J3.5 R10.1
HMI_BUTTON_5 [signal]: J3.6 R9.1
HMI_BUTTON_6: J3.7 R8.1
HMI_BUTTON_CPU_1: U4.1(1A) ; also sheet 2
HMI_BUTTON_CPU_2: U4.3(2A) ; also sheet 2
HMI_BUTTON_CPU_3: U4.6(3A) ; also sheet 2
HMI_BUTTON_CPU_4: U3.1(1A) ; also sheet 2
HMI_BUTTON_CPU_5: U3.3(2A) ; also sheet 2
HMI_BUTTON_CPU_6: U3.6(3A) ; also sheet 2
HMI_LCD_BACKLIGHT: R15.2 ; also sheet 2
HMI_LCD_LED+: J1.1 R3.2 T1.3(C)
HMI_LCD_SCL [signal]: J1.6 R14.2 U2.3(SCL) ; also sheet 2
HMI_LCD_SDA [signal]: J1.5 R2.2 U2.4(SDA) ; also sheet 2
HMI_LCD_VO: J1.7 U2.5(W)
HMI_LED_1 [signal]: R7.1 ; also sheet 2
HMI_LED_2 [signal]: R6.2 ; also sheet 2
HMI_LED_3 [signal]: R5.1 ; also sheet 2
HMI_LED_4 [signal]: R4.2 ; also sheet 2
N$1: J2.3 R6.1
N$2: J2.5 R4.1
N$7: R15.1 T1.1(B)
N$17: C102.1 R13.2 U4.7(1Y)
N$19: C103.1 R12.2 U4.5(2Y)
N$20: C104.1 R11.2 U4.2(3Y)
N$25: C105.1 R10.2 U3.7(1Y)
N$26: C106.1 R9.2 U3.5(2Y)
N$27: C107.1 R8.2 U3.2(3Y)
N$63: J2.2 R7.2
N$64: J2.4 R5.2
Unconnected: J1.8

## Sheet 5 of 5: Power
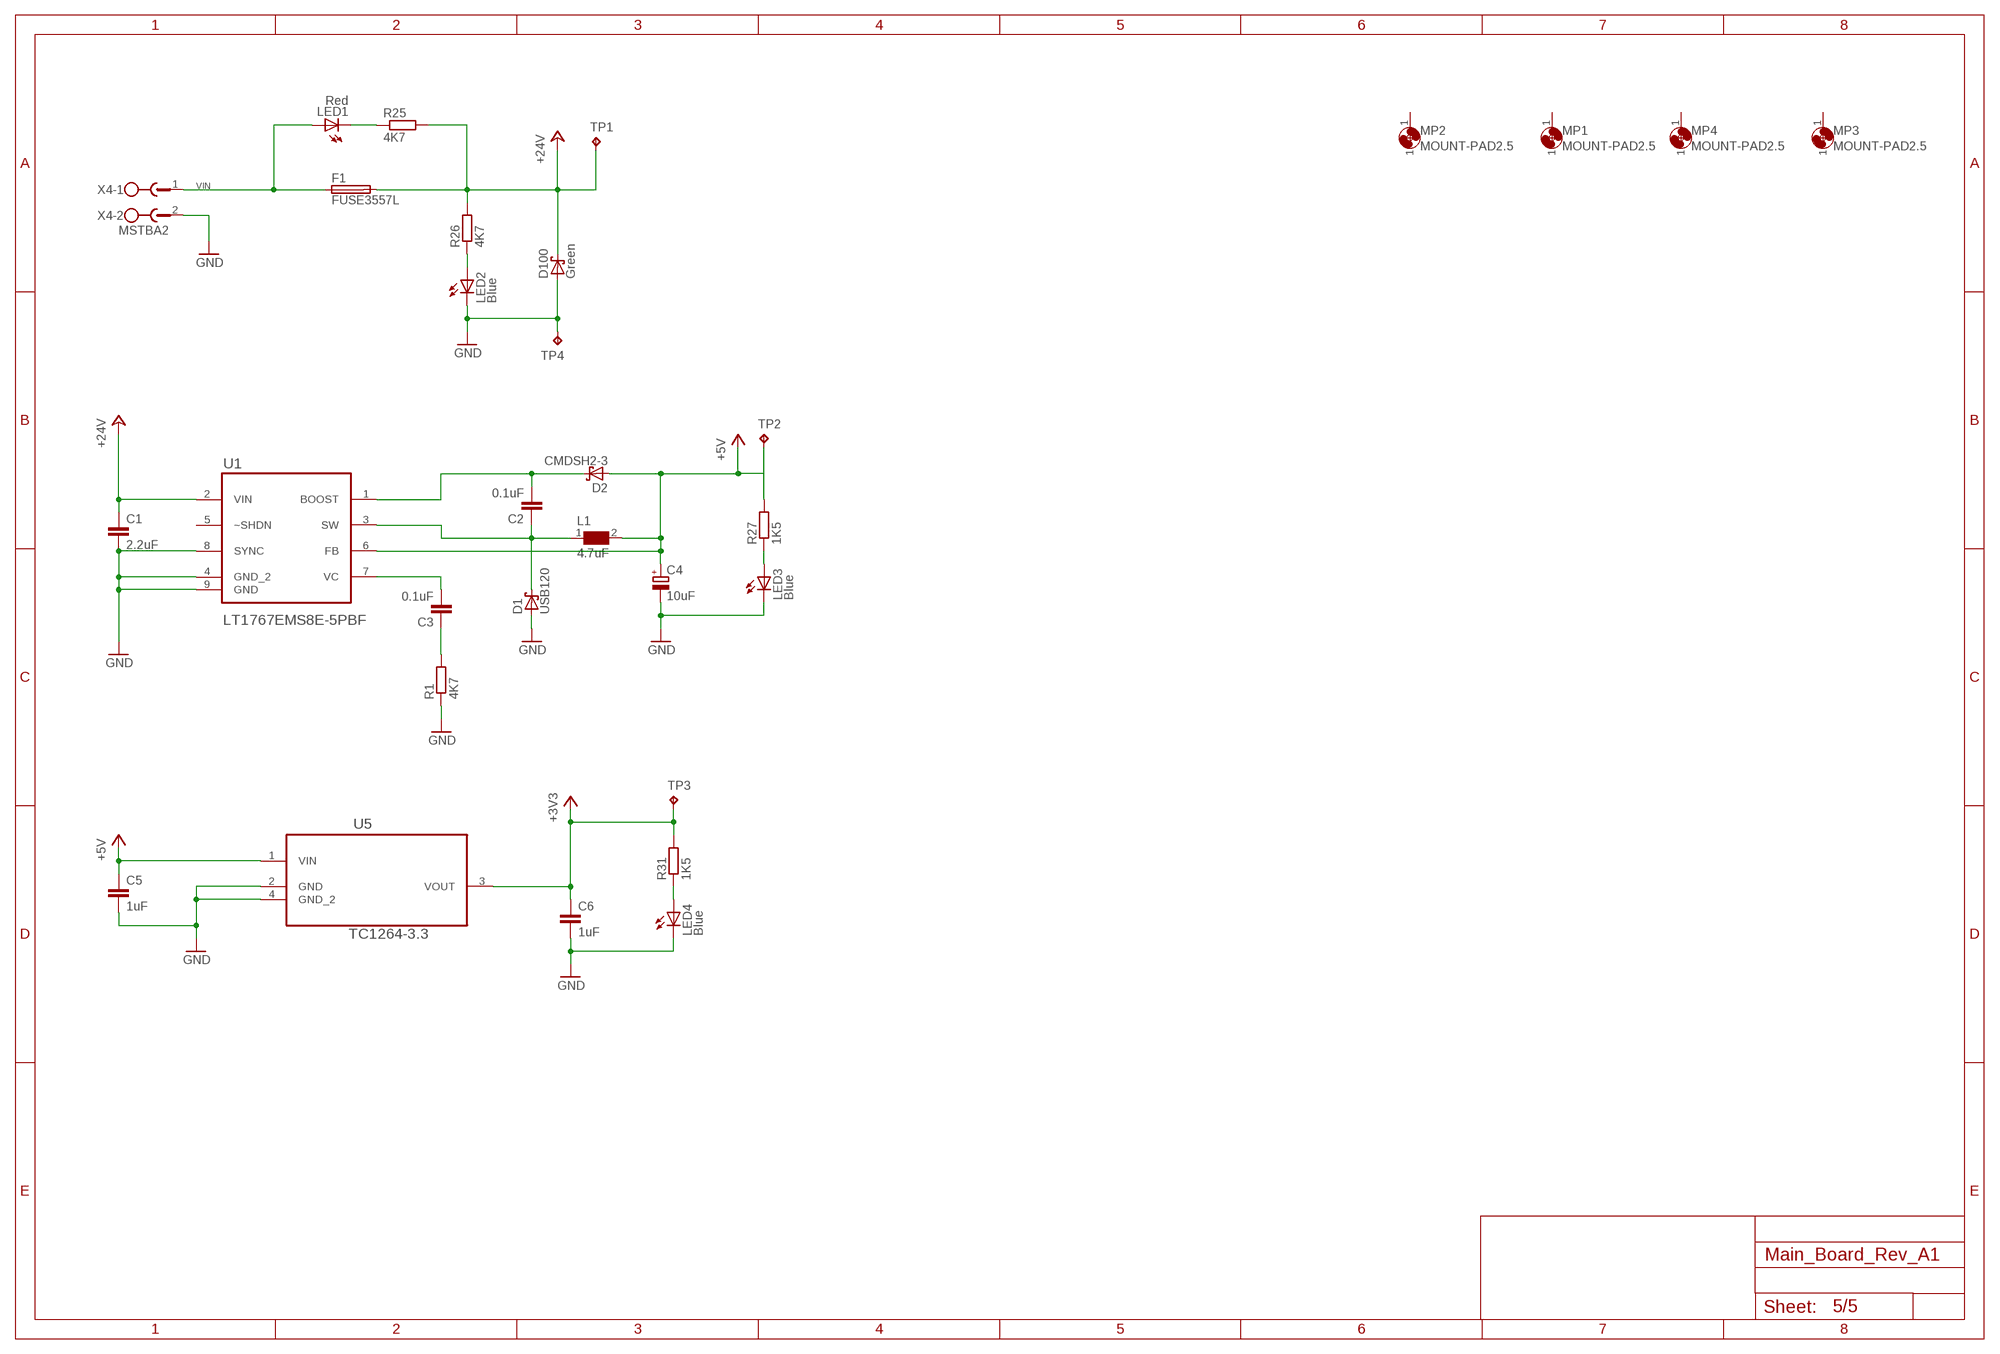
[diagram p4: schematic, sheet 5]

### Parts
C1  2.2uF  C-EUC0603  [C0603]
C2  0.1uF  C-EUC0603  [C0603]
C3  0.1uF  C-EUC0603  [C0603]
C4  10uF  CPOL-EUCT3216  [CT3216]
C5  1uF  C-EUC0603  [C0603]
C6  1uF  C-EUC0603  [C0603]
D1  USB120  [DO216AA]
D2  CMDSH2-3  [SOD323-W]
D100  Green  STPS3L40UF  [SMB]
F1  FUSE3557L  [3557-LITTLE]
L1  4.7uF  WE-PD-7447713047_1030/1050  [WE-PD_1030/1050]
LED1  Red  LEDCHIPLED_0603  [CHIPLED_0603]
LED2  Blue  LEDCHIPLED_0603  [CHIPLED_0603]
LED3  Blue  LEDCHIP-LED0603  [CHIP-LED0603]
LED4  Blue  LEDCHIP-LED0603  [CHIP-LED0603]
MP1  MOUNT-PAD2.5  [P2.5]
MP2  MOUNT-PAD2.5  [P2.5]
MP3  MOUNT-PAD2.5  [P2.5]
MP4  MOUNT-PAD2.5  [P2.5]
R1  4K7  R-EU_R0603  [R0603]
R25  4K7  R-EU_R0603  [R0603]
R26  4K7  R-EU_R0603  [R0603]
R27  1K5  R-EU_R0603  [R0603]
R31  1K5  R-EU_R0603  [R0603]
TP1  TPB1,27  [B1,27]
TP2  TPB1,27  [B1,27]
TP3  TPB1,27  [B1,27]
TP4  TPB1,27  [B1,27]
U1  LT1767EMS8E-5PBF  [SOP65P490X110-9N]
U5  TC1264-3.3  [SOT230P700X180-4N]
X4  MSTBA2  [MSTBA2]

### Nets
+3V3 [supply]: C6.1 R31.2 TP3.TP U5.3(VOUT) ; also sheet 1,2,3,4
+5V [supply]: C4.+ C5.1 D2.A L1.2 R27.2 TP2.TP U1.6(FB) U5.1(VIN) ; also sheet 1,3,4
+24V: C1.1 D100.C F1.3 F1.4 R25.2 R26.2 TP1.TP U1.2(VIN) ; also sheet 1,3
GND [supply]: C1.2 C4.- C5.2 C6.2 D1.A D100.A LED2.C LED3.C LED4.C R1.1 TP4.TP U1.4(GND_2) U1.8(SYNC) U1.9(GND) U5.2(GND) U5.4(GND_2) X4.2 ; also sheet 1,2,3,4
N$43: C2.2 D2.C U1.1(BOOST)
N$44: LED2.A R26.1
N$45: LED1.C R25.1
N$47: C3.1 R1.2
N$48: C3.2 U1.7(VC)
N$49: C2.1 D1.C L1.1 U1.3(SW)
N$50: LED4.A R31.1
N$51: LED3.A R27.1
VIN: F1.1 F1.2 LED1.A X4.1
Unconnected: MP1.1 MP2.1 MP3.1 MP4.1 U1.5(~SHDN)

## Library data of the parts
C1-C3 C7-C13 C101-C109 C111-C120 C123-C140 = rcl:C-EU: CAPACITOR, European symbol
C4 C100 C110 C121 C122 = rcl:CPOL-EU: POLARIZED CAPACITOR, European symbol
C5 C6 = rcl:C-EU: CAPACITOR, European symbol; OC_FARNELL: unknown
D1 = diode:USB120
D2 = diode:CMDSH2-3
D100 = diode:STPS3L40?; MP: STMICROELECTRONICS; MPN: STPS3L40UF; OC_FARNELL: 2341599
F1 = fuse2:FUSE: Fuse
J1 J3 = Molex_By_element14_Batch_1:90814-0208: CONN HEADER 8POS 1.27MM SMD TIN; MPN: 90814-0208; OC_FARNELL: 1757025; OC_NEWARK: 34R6216; PACKAGE: CONN-8POS; SUPPLIER: Molex
J2 = Molex_By_element14_Batch_1:90814-0206: CONN HEADER 06 POS 1.27MM SMD TIN; MPN: 90814-0206; OC_FARNELL: 1757024; OC_NEWARK: 34R6215; PACKAGE: CONN-6 POS; SUPPLIER: Molex
JP1 JP2 JP4 JP5 = SparkFun:FIDUCIAL: Fiducial Alignment Points Various fiducial points for machine vision alignment.
JP3 = exmachina:BC-2?
K1-K4 = relay:G6K: Low Signal Relay oeiwcsnts1.omron.com/.. D20G6K0100.pdf; OC_FARNELL: 4484794; OC_NEWARK: unknown
L1 = WE-PD:WE-PD: SMD-Shielded Power Inductors WE-PD - Magnetically shielded version which results in a low leakage field - High storage capacity - Low self-losses - Highest possible current loading for SMD-Inducors -- Switching regulators with low operating voltages (computer, laptop, mobile phones, pagers) -- Integrated DC/DC-converter -- Is recommended for the application with switching regulators from National Semiconductor, Linear Technology, Texas Instruments and Fairchild Semiconductor, ect. -- Graphic cards -- Plastic base: Because of the one piece construction these are more suitable for high vibration or shock applications; MPN: 7447713047; OC_FARNELL: 2082661; OC_NEWARK: 88T7091; PACKAGE: 1030; SUPPLIER: Wuerth Elektronik
L100 = coilcraft:0603PS
LED1 LED2 LED5-LED9 = led:LED: LED OSRAM: - CHIPLED LG R971, LG N971, LY N971, LG Q971, LY Q971, LO R971, LY R971 LH N974, LH R974 LS Q976, LO Q976, LY Q976 LO Q996 - Hyper CHIPLED LW Q18S LB Q993, LB Q99A, LB R99A - SideLED LS A670, LO A670, LY A670, LG A670, LP A670 LB A673, LV A673, LT A673, LW A673 LH A674 LY A675 LS A676, LA A676, LO A676, LY A676, LW A676 LS A679, LY A679, LG A679 - Hyper Micro SIDELED® LS Y876, LA Y876, LO Y876, LY Y876 LT Y87S - SmartLED LW L88C, LW L88S LB L89C, LB L89S, LG L890 LS L89K, LO L89K, LY L89K LS L896, LA L896, LO L896, LY L896 - TOPLED LS T670, LO T670, LY T670, LG T670, LP T670 LSG T670, LSP T670, LSY T670, LOP T670, LYG T670 LG T671, LOG T671, LSG T671 LB T673, LV T673, LT T673, LW T673 LH T674 LS T676, LA T676, LO T676, LY T676, LB T676, LH T676, LSB T676, LW T676 LB T67C, LV T67C, LT T67C, LS T67K, LO T67K, LY T67K, LW E67C LS E67B, LA E67B, LO E67B, LY E67B, LB E67C, LV E67C, LT E67C LW T67C LS T679, LY T679, LG T679 LS T770, LO T770, LY T770, LG T770, LP T770 LB T773, LV T773, LT T773, LW T773 LH T774 LS E675, LA E675, LY E675, LS T675 LS T776, LA T776, LO T776, LY T776, LB T776 LHGB T686 LT T68C, LB T68C - Hyper Mini TOPLED® LB M676 - Mini TOPLED Santana® LG M470 LS M47K, LO M47K, LY M47K Source: http://www.osram.convergy.de LUXEON: - LUMILED® LXK2-PW12-R00, LXK2-PW12-S00, LXK2-PW14-U00, LXK2-PW14-V00 LXK2-PM12-R00, LXK2-PM12-S00, LXK2-PM14-U00 LXK2-PE12-Q00, LXK2-PE12-R00, LXK2-PE12-S00, LXK2-PE14-T00, LXK2-PE14-U00 LXK2-PB12-K00, LXK2-PB12-L00, LXK2-PB12-M00, LXK2-PB14-N00, LXK2-PB14-P00, LXK2-PB14-Q00 LXK2-PR12-L00, LXK2-PR12-M00, LXK2-PR14-Q00, LXK2-PR14-R00 LXK2-PD12-Q00, LXK2-PD12-R00, LXK2-PD12-S00 LXK2-PH12-R00, LXK2-PH12-S00 LXK2-PL12-P00, LXK2-PL12-Q00, LXK2-PL12-R00 Source: www.luxeon.com KINGBRIGHT: KA-3528ASYC Source: www.kingbright.com
LED3 LED4 = led:LED: LED OSRAM: - CHIPLED LG R971, LG N971, LY N971, LG Q971, LY Q971, LO R971, LY R971 LH N974, LH R974 LS Q976, LO Q976, LY Q976 LO Q996 - Hyper CHIPLED LW Q18S LB Q993, LB Q99A, LB R99A - SideLED LS A670, LO A670, LY A670, LG A670, LP A670 LB A673, LV A673, LT A673, LW A673 LH A674 LY A675 LS A676, LA A676, LO A676, LY A676, LW A676 LS A679, LY A679, LG A679 - Hyper Micro SIDELED® LS Y876, LA Y876, LO Y876, LY Y876 LT Y87S - SmartLED LW L88C, LW L88S LB L89C, LB L89S, LG L890 LS L89K, LO L89K, LY L89K LS L896, LA L896, LO L896, LY L896 - TOPLED LS T670, LO T670, LY T670, LG T670, LP T670 LSG T670, LSP T670, LSY T670, LOP T670, LYG T670 LG T671, LOG T671, LSG T671 LB T673, LV T673, LT T673, LW T673 LH T674 LS T676, LA T676, LO T676, LY T676, LB T676, LH T676, LSB T676, LW T676 LB T67C, LV T67C, LT T67C, LS T67K, LO T67K, LY T67K, LW E67C LS E67B, LA E67B, LO E67B, LY E67B, LB E67C, LV E67C, LT E67C LW T67C LS T679, LY T679, LG T679 LS T770, LO T770, LY T770, LG T770, LP T770 LB T773, LV T773, LT T773, LW T773 LH T774 LS E675, LA E675, LY E675, LS T675 LS T776, LA T776, LO T776, LY T776, LB T776 LHGB T686 LT T68C, LB T68C - Hyper Mini TOPLED® LB M676 - Mini TOPLED Santana® LG M470 LS M47K, LO M47K, LY M47K Source: http://www.osram.convergy.de LUXEON: - LUMILED® LXK2-PW12-R00, LXK2-PW12-S00, LXK2-PW14-U00, LXK2-PW14-V00 LXK2-PM12-R00, LXK2-PM12-S00, LXK2-PM14-U00 LXK2-PE12-Q00, LXK2-PE12-R00, LXK2-PE12-S00, LXK2-PE14-T00, LXK2-PE14-U00 LXK2-PB12-K00, LXK2-PB12-L00, LXK2-PB12-M00, LXK2-PB14-N00, LXK2-PB14-P00, LXK2-PB14-Q00 LXK2-PR12-L00, LXK2-PR12-M00, LXK2-PR14-Q00, LXK2-PR14-R00 LXK2-PD12-Q00, LXK2-PD12-R00, LXK2-PD12-S00 LXK2-PH12-R00, LXK2-PH12-S00 LXK2-PL12-P00, LXK2-PL12-Q00, LXK2-PL12-R00 Source: www.luxeon.com KINGBRIGHT: KA-3528ASYC Source: www.kingbright.com; MF: MULTICOMP; MPN: OVS-0604; OC_FARNELL: 1716771; OC_NEWARK: 15R2206
MP1-MP4 = holes:MOUNT-PAD: MOUNTING HOLE with drill center marker
R1-R26 R28-R30 R32-R66 R100-R111 = rcl:R-EU_: RESISTOR, European symbol
R27 R31 = rcl:R-EU_: RESISTOR, European symbol; MF: MULTICOMP; MPN: MCMR06X1501FTL; OC_FARNELL: 2073391; OC_NEWARK: 58K4488
SJ1-SJ3 = SparkFun-Passives:SOLDERJUMPER: Solder Jumper Standard SMD solder jumper. Used to automate production. Two varients : Normally Open and Normally Closed are the same, but have different paste layers. NC will have a large amount of paste and should jumper during reflow.
SW1 SW2 = Switch_SMT:B3FS: Surface-mounting Switches Ideal for High-density Mounting
T1 = transistor:MMBT2222AL: General Purpose Transistors
TP1 TP4 = testpad:TP: Test pad
TP2 TP3 = testpad:TP: Test pad; OC_FARNELL: unknown; OC_NEWARK: unknown
U1 = lineartechnology:LT1767EMS8E-5PBF: Step-Down Switching Regulators; MPN: LT1767EMS8E-5#PBF; OC_FARNELL: 1663491; OC_NEWARK: 57M6275; PACKAGE: MSOP-8; SUPPLIER: Linear Technology
U2 = ti:TPL0401
U3 U4 U13 = ti:SN74LVC3G17DCTR: TRIPLE SCHMITT-TRIGGER BUFFER; MPN: SN74LVC3G17DCTR; OC_FARNELL: 1236391; OC_NEWARK: 90H3713; PACKAGE: SSOP-8; SUPPLIER: Texas Instruments
U5 = microchip-6:TC1264-3.3: IC, 8 00mA Fixed Output CMOS LDO,3.3V,SOT-223, 3-lead; OC_FARNELL: unknown; PACKAGE: SOT-223-3; SUPPLIER: Microchip
U6 = texas:DP83848JSQ/NOPB; COPYRIGHT: Copyright (C) 2015 Accelerated Designs. All rights reserved; MANUFACTURER_PART_NUMBER: dp83848jsqnopb; VENDOR: National Semiconductor
U7 = NXP:LPC1768FBD100; COPYRIGHT: Copyright C 2015 Accelerated Designs. All rights reserved; MANUFACTURER_PART_NUMBER: lpc1768fbd100; VENDOR: NXP
U8 = atmel:AT24C512C-SSHM-B: SERIAL EEPROM IC Memory Size:512Kbit,8-SOIC; MPN: AT24C02C-SSHM-B; OC_FARNELL: 1971995; OC_NEWARK: 68T4066; PACKAGE: 8SOIC; SUPPLIER: ATMEL
U9 U10 = ti:SN74LVC2G17DBVR: DUAL SCHMITT-TRIGGER BUFFER; MPN: SN74LVC2G17DBVR; OC_FARNELL: 1470776; OC_NEWARK: 76C4207; PACKAGE: SOT-23-6; SUPPLIER: Texas Instruments
U11 = Microchip_By_element14_Batch_1:MCP2561-E/SN: High-Speed CAN Transceiver; MPN: MCP2551-I/SN; PACKAGE: SOIC-8; SUPPLIER: Microchip
U12 = ti:TLV313
U$1 = keystone:3000
U$2 = exmachina:EXMACHINA-LOGO
X1 X5 X8 X12 X13 = con-molex:22-?-02: CONNECTOR wire to board 2.54 mm (.1 inch) pitch header; OC_FARNELL: 9731601; OC_NEWARK: unknown
X2 = con-molex:22-?-06: CONNECTOR wire to board 2.54 mm (.1 inch) pitch header; OC_FARNELL: unknown; OC_NEWARK: unknown
X3 = con-wiznet:RB1-125BAG1A: Accessory RJ-45 With Transformer Connector - UDE
X4 = con-phoenix-508:MSTBA2: PHOENIX; MF: FARNELL; MPN: 1757242; OC_FARNELL: 3705171; OC_NEWARK: 71C4161
X6 = con-GlobalConnectorTechnology:USB3075-30-A
X7 = con-samtec:FTSH-105-01-L-DV
X9 = con-amp:1241050-5
X10 X16 X17 = con-molex:22-?-04: CONNECTOR wire to board 2.54 mm (.1 inch) pitch header; OC_FARNELL: unknown; OC_NEWARK: unknown
X11 = con-multicomp:5504F1-09S-02A-03: D-Sub 9pts, Righ-angle, solder
X14 X15 = con-molex:22-?-03: CONNECTOR wire to board 2.54 mm (.1 inch) pitch header; OC_FARNELL: 9731610; OC_NEWARK: unknown
X18 = con-molex:22-?-05: CONNECTOR wire to board 2.54 mm (.1 inch) pitch header; OC_FARNELL: unknown; OC_NEWARK: unknown
XT1 XT3 = crystal:ASE: 3.3Vdc CMOS SMD CRYSTAL CLOCK OSCILLATOR SOurce: www.abracon.com; OC_FARNELL: unknown; OC_NEWARK: unknown
XT2 = crystal:FC-135: 32.768kHz ±20ppm Crystal 12.5pF 70 kOhm -40°C ~ 85°C Surface Mount 2-SMD

## Net classes
1 signal: width 0.178 mm, drill 0.35 mm
2 supply: width 0.008 mm, drill 0.5 mm